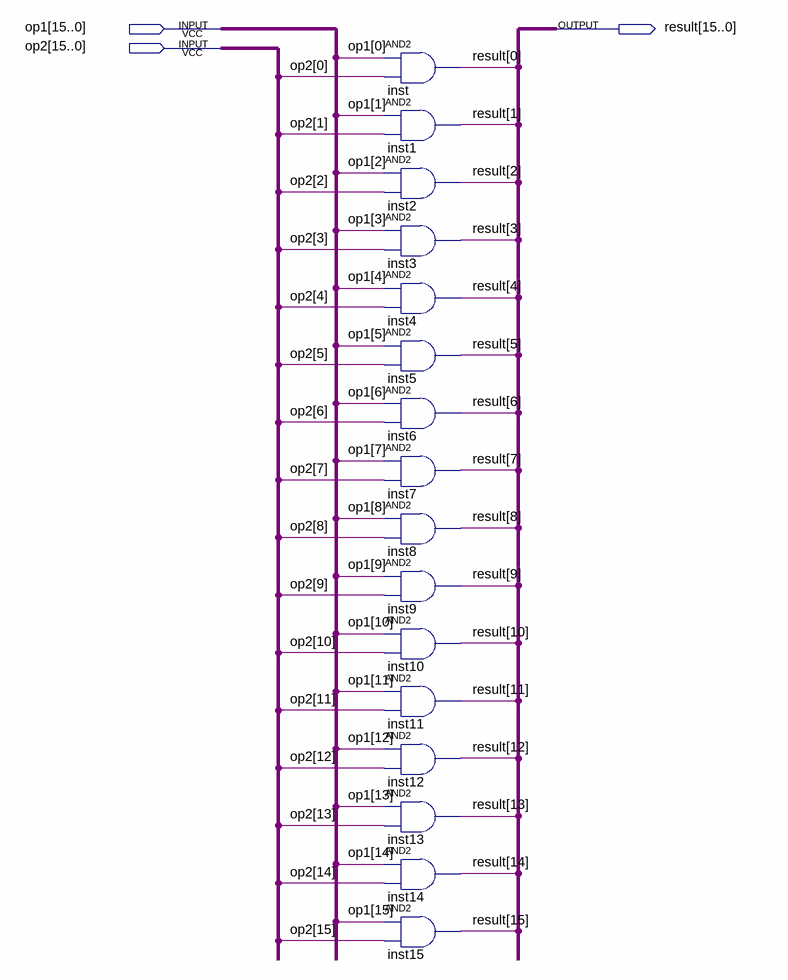
[diagram p0: schematic sheet]
// Quartus schematic 16and.bdf as structural Verilog: 16 symbols, 3 pins
module \16and  (
  input  [15:0] op1,
  input  [15:0] op2,
  output [15:0] result
);

  and inst (result[0], op1[0], op2[0]);
  and inst1 (result[1], op1[1], op2[1]);
  and inst2 (result[2], op1[2], op2[2]);
  and inst3 (result[3], op1[3], op2[3]);
  and inst4 (result[4], op1[4], op2[4]);
  and inst5 (result[5], op1[5], op2[5]);
  and inst6 (result[6], op1[6], op2[6]);
  and inst7 (result[7], op1[7], op2[7]);
  and inst8 (result[8], op1[8], op2[8]);
  and inst9 (result[9], op1[9], op2[9]);
  and inst10 (result[10], op1[10], op2[10]);
  and inst11 (result[11], op1[11], op2[11]);
  and inst12 (result[12], op1[12], op2[12]);
  and inst13 (result[13], op1[13], op2[13]);
  and inst14 (result[14], op1[14], op2[14]);
  and inst15 (result[15], op1[15], op2[15]);
endmodule
